# EAGLE schematic calkabot1 (EAGLE 8.6.0)
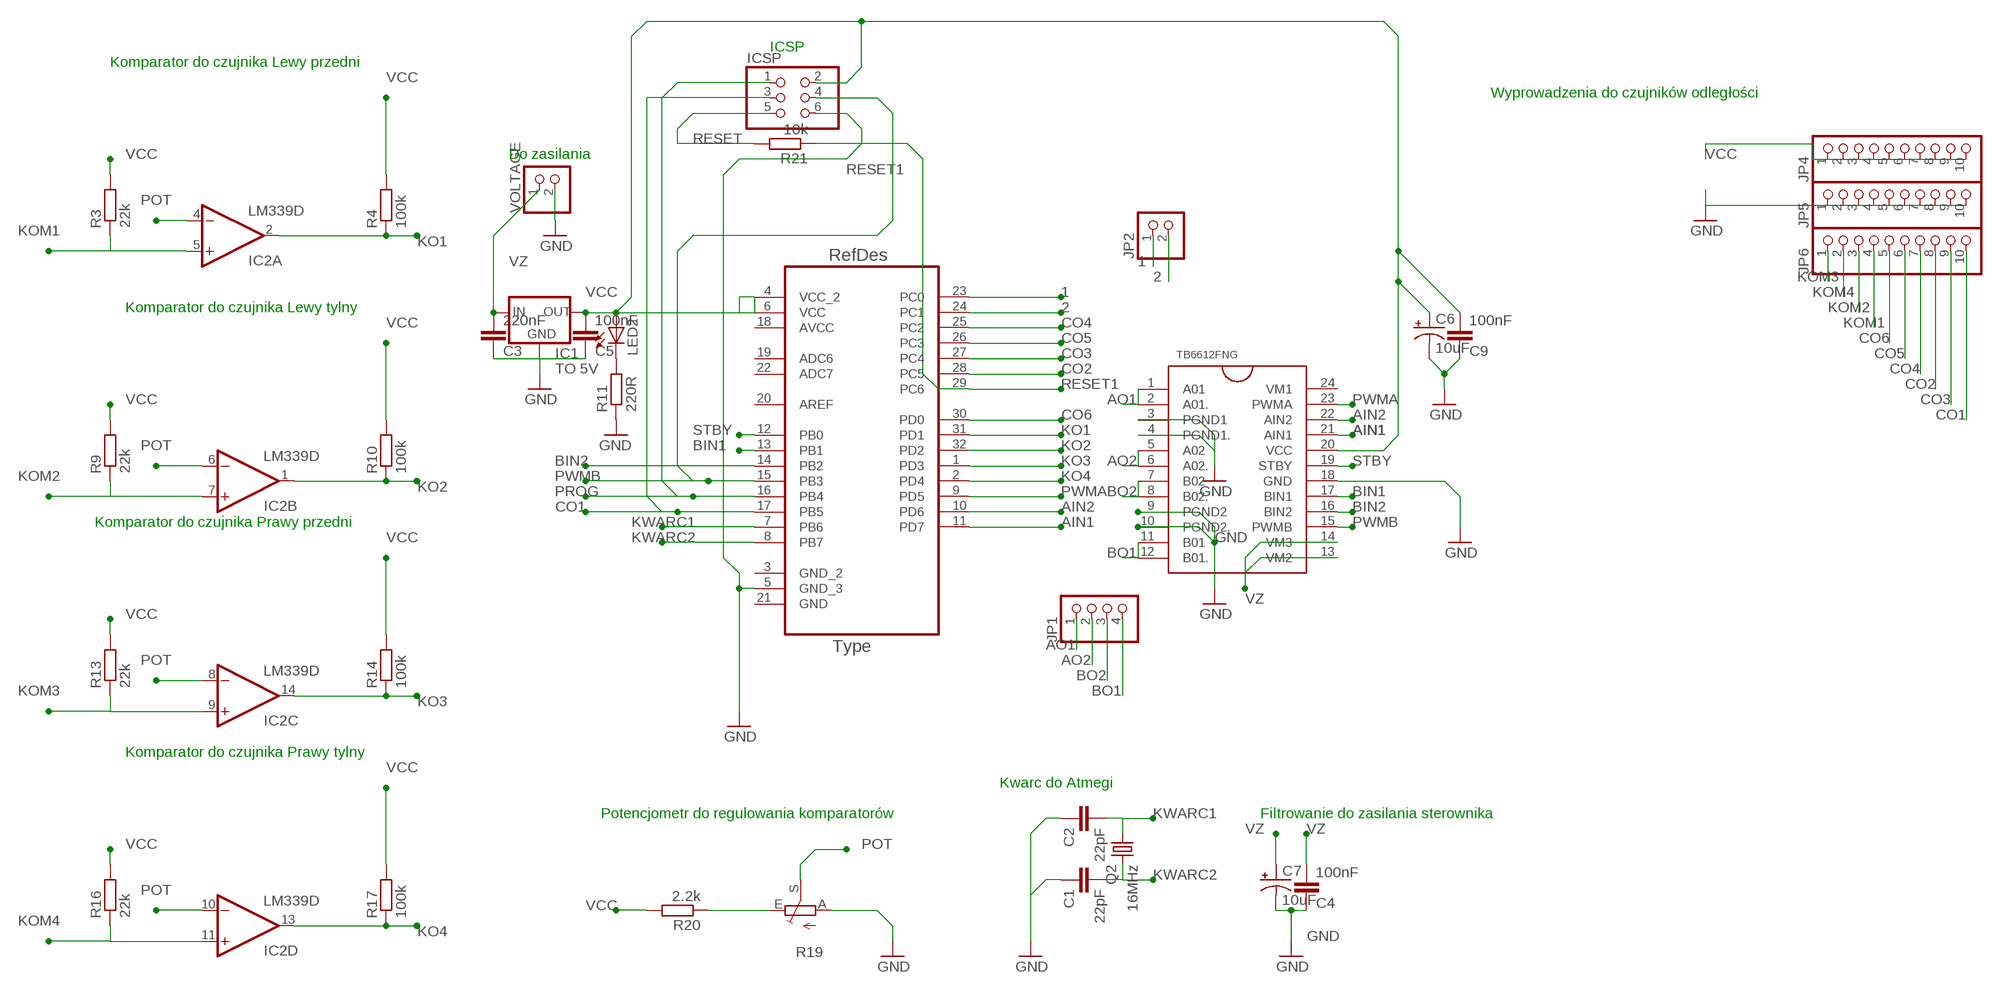
[diagram p0: schematic, sheet 1]

## Parts
C1  22pF  C-EUC0805  [C0805]
C2  22pF  C-EUC0805  [C0805]
C3  220nF  C-EUC0805  [C0805]
C4  100nF  C-EUC0805  [C0805]
C5  100nF  C-EUC0805  [C0805]
C6  10uF  22UF-POLAR-PANASONIC_C-35V-20%  [PANASONIC_C]
C7  10uF  22UF-POLAR-PANASONIC_C-35V-20%  [PANASONIC_C]
C9  100nF  C-EUC0805  [C0805]
IC1  TO 5V  LM1117T-5.0-V  [TO220V]
IC2  LM339D  [SO14]
ICSP  PINHD-2X3  [2X03]
JP1  PINHD-1X4  [1X04]
JP2  PINHD-1X2  [1X02]
JP4  PINHD-1X10  [1X10]
JP5  PINHD-1X10  [1X10]
JP6  PINHD-1X10  [1X10]
LED2  LEDCHIPLED_0805  [CHIPLED_0805]
Q2  16MHz  CSM-7X-DU  [CSM-7X-DU]
R3  22k  R-EU_M0805  [M0805]
R4  100k  R-EU_M0805  [M0805]
R9  22k  R-EU_M0805  [M0805]
R10  100k  R-EU_M0805  [M0805]
R11  220R  R-EU_M0805  [M0805]
R13  22k  R-EU_M0805  [M0805]
R14  100k  R-EU_M0805  [M0805]
R16  22k  R-EU_M0805  [M0805]
R17  100k  R-EU_M0805  [M0805]
R19  TRIM_EU-B25P  [B25P]
R20  2.2k  R-EU_M0805  [M0805]
R21  10k  R-EU_M0805  [M0805]
U1  ATMEGA328P-AU  [QFP80P900X900X120-32N]
U$1  TB6612FNG  [SSOP24]
VOLTAGE  PINHD-1X2  [1X02]

## Nets
1: JP2.1 U1.23(PC0)
2: JP2.2 U1.24(PC1)
AIN1: U1.11(PD7) U$1.21(AIN1)
AIN2: U1.10(PD6) U$1.22(AIN2)
AO1: JP1.1 U$1.1(A01) U$1.2(A01.)
AO2: JP1.2 U$1.5(A02) U$1.6(A02.)
BIN1: U1.13(PB1) U$1.17(BIN1)
BIN2: U1.14(PB2) U$1.16(BIN2)
BO1: JP1.4 U$1.11(B01) U$1.12(B01.)
BO2: JP1.3 U$1.7(B02) U$1.8(B02.)
CO1: ICSP.3 JP6.10 U1.17(PB5)
CO2: JP6.8 U1.28(PC5)
CO3: JP6.9 U1.27(PC4)
CO4: JP6.7 U1.25(PC2)
CO5: JP6.6 U1.26(PC3)
CO6: JP6.5 U1.30(PD0)
GND: C1.1 C2.1 C3.1 C4.1 C5.1 C6.- C7.- C9.1 IC1.1(GND) ICSP.6 JP5.10 R11.1 R19.A U1.5(GND_3) U$1.3(PGND1) U$1.4(PGND1.) U$1.9(PGND2) U$1.10(PGND2.) U$1.18(GND) VOLTAGE.2
KO1: IC2.2(A:OUT) R4.1 U1.31(PD1)
KO2: IC2.1(B:OUT) R10.1 U1.32(PD2)
KO3: IC2.14(C:OUT) R14.1 U1.1(PD3)
KO4: IC2.13(D:OUT) R17.1 U1.2(PD4)
KOM1: IC2.5(A:+IN) JP6.4 R3.1
KOM2: IC2.7(B:+IN) JP6.3 R9.1
KOM3: IC2.9(C:+IN) JP6.1 R13.1
KOM4: IC2.11(D:+IN) JP6.2 R16.1
KWARC1: C2.2 Q2.1 U1.7(PB6)
KWARC2: C1.2 Q2.2 U1.8(PB7)
N$6: R19.E R20.1
N$7: LED2.C R11.2
POT: IC2.4(A:-IN) IC2.6(B:-IN) IC2.8(C:-IN) IC2.10(D:-IN) R19.S
PROG: ICSP.1 U1.16(PB4)
PWMA: U1.9(PD5) U$1.23(PWMA)
PWMB: ICSP.4 U1.15(PB3) U$1.15(PWMB)
RESET: ICSP.5 R21.2
RESET1: R21.1 U1.29(PC6)
STBY: U1.12(PB0) U$1.19(STBY)
VCC: C5.2 C6.+ C9.2 IC1.2(OUT) ICSP.2 JP4.10 LED2.A R3.2 R4.2 R9.2 R10.2 R13.2 R14.2 R16.2 R17.2 R20.2 U1.4(VCC_2) U1.6(VCC) U$1.20(VCC)
VZ: C3.2 C4.2 C7.+ IC1.3(IN) U$1.13(VM2) U$1.14(VM3) VOLTAGE.1
Unconnected: JP4.1 JP4.2 JP4.3 JP4.4 JP4.5 JP4.6 JP4.7 JP4.8 JP4.9 JP5.1 JP5.2 JP5.3 JP5.4 JP5.5 JP5.6 JP5.7 JP5.8 JP5.9 U1.3(GND_2) U1.19(ADC6) U1.20(AREF) U1.21(GND) U1.22(ADC7) U$1.24(VM1)

## Notes on the sheet
- ICSP
- Komparator do czujnika Lewy przedni
- Wyprowadzenia do czujników odległości
- Do zasilania
- Komparator do czujnika Lewy tylny
- Komparator do czujnika Prawy przedni
- Komparator do czujnika Prawy tylny
- Kwarc do Atmegi
- Potencjometr do regulowania komparatorów | Filtrowanie do zasilania sterownika

## Power pins joined to a net without a drawn wire
AVCC: U1.18(AVCC)
GND: IC2.12(P:GND)
V+: IC2.3(P:V+)

## Library data of the parts
C1-C5 C9 = rcl:C-EU: CAPACITOR, European symbol; SPICEPREFIX: C
C6 C7 = SparkFun-Capacitors:22UF-POLAR: 22µF polarized capacitors A capacitor is a passive two-terminal electrical component used to store electrical energy temporarily in an electric field.; PROD_ID: CAP-08618; VALUE: 22uF
IC1 = lm1117:LM1117T-*
IC2 = linear:LM339: Low Power Low Offset Voltage Quad Comparators with open collector; LM139/LM239/LM339/LM2901/LM3302
ICSP = pinhead:PINHD-2X3: PIN HEADER
JP1 = pinhead:PINHD-1X4: PIN HEADER
JP2 VOLTAGE = pinhead:PINHD-1X2: PIN HEADER
JP4-JP6 = pinhead:PINHD-1X10: PIN HEADER
LED2 = led:LED: LED OSRAM: - CHIPLED LG R971, LG N971, LY N971, LG Q971, LY Q971, LO R971, LY R971 LH N974, LH R974 LS Q976, LO Q976, LY Q976 LO Q996 - Hyper CHIPLED LW Q18S LB Q993, LB Q99A, LB R99A - SideLED LS A670, LO A670, LY A670, LG A670, LP A670 LB A673, LV A673, LT A673, LW A673 LH A674 LY A675 LS A676, LA A676, LO A676, LY A676, LW A676 LS A679, LY A679, LG A679 - Hyper Micro SIDELED® LS Y876, LA Y876, LO Y876, LY Y876 LT Y87S - SmartLED LW L88C, LW L88S LB L89C, LB L89S, LG L890 LS L89K, LO L89K, LY L89K LS L896, LA L896, LO L896, LY L896 - TOPLED LS T670, LO T670, LY T670, LG T670, LP T670 LSG T670, LSP T670, LSY T670, LOP T670, LYG T670 LG T671, LOG T671, LSG T671 LB T673, LV T673, LT T673, LW T673 LH T674 LS T676, LA T676, LO T676, LY T676, LB T676, LH T676, LSB T676, LW T676 LB T67C, LV T67C, LT T67C, LS T67K, LO T67K, LY T67K, LW E67C LS E67B, LA E67B, LO E67B, LY E67B, LB E67C, LV E67C, LT E67C LW T67C LS T679, LY T679, LG T679 LS T770, LO T770, LY T770, LG T770, LP T770 LB T773, LV T773, LT T773, LW T773 LH T774 LS E675, LA E675, LY E675, LS T675 LS T776, LA T776, LO T776, LY T776, LB T776 LHGB T686 LT T68C, LB T68C - Hyper Mini TOPLED® LB M676 - Mini TOPLED Santana® LG M470 LS M47K, LO M47K, LY M47K Source: http://www.osram.convergy.de LUXEON: - LUMILED® LXK2-PW12-R00, LXK2-PW12-S00, LXK2-PW14-U00, LXK2-PW14-V00 LXK2-PM12-R00, LXK2-PM12-S00, LXK2-PM14-U00 LXK2-PE12-Q00, LXK2-PE12-R00, LXK2-PE12-S00, LXK2-PE14-T00, LXK2-PE14-U00 LXK2-PB12-K00, LXK2-PB12-L00, LXK2-PB12-M00, LXK2-PB14-N00, LXK2-PB14-P00, LXK2-PB14-Q00 LXK2-PR12-L00, LXK2-PR12-M00, LXK2-PR14-Q00, LXK2-PR14-R00 LXK2-PD12-Q00, LXK2-PD12-R00, LXK2-PD12-S00 LXK2-PH12-R00, LXK2-PH12-S00 LXK2-PL12-P00, LXK2-PL12-Q00, LXK2-PL12-R00 Source: www.luxeon.com KINGBRIGHT: KA-3528ASYC Source: www.kingbright.com
Q2 = crystal:CSM-7X-DU: SMD CRYSTAL Source: www.ecsxtal.com .. Crystal 3.6864MHz CSM_7X_DU.PDF; OC_FARNELL: unknown; OC_NEWARK: unknown
R3 R4 R9-R11 R13 R14 R16 R17 R20 R21 = resistor:R-EU_: RESISTOR, European symbol
R19 = pot:TRIM_EU-: POTENTIOMETER
U1 = Atmel-ATMEGA328P-AU:ATMEGA328P-AU; DESCRIPTION: 8-bit Microcontroller with In-System Programmable Flash; MPN: ATMEGA328P-AU; OC_FARNELL: 1715486; OC_NEWARK: 14R4631; PACKAGE: TQFP-32; SUPPLIER: Atmel
U$1 = TB6612FNG:TB6612FNG